# Altium schematic sheet Digital Camera.SchDoc
size A4; SheetSize: A4 P
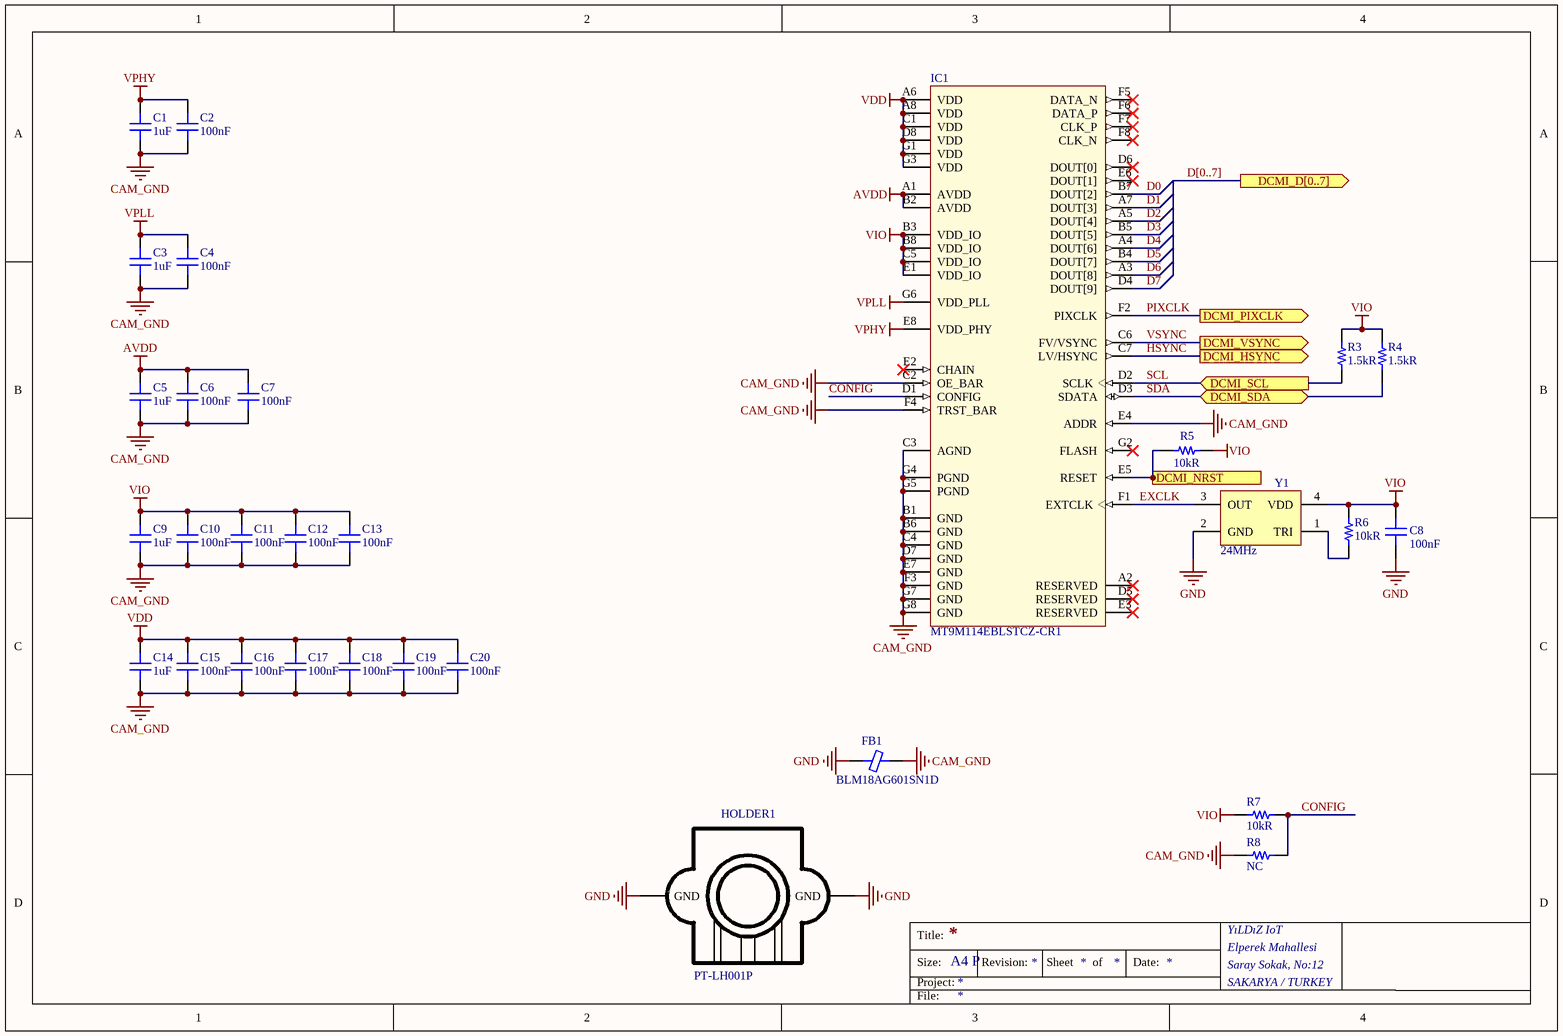
[diagram p0: Digital Camera.SchDoc]

## Parts
C1  1uF  [CAP 0603/1608]
C2  100nF  [CAP 0603/1608]
C3  1uF  [CAP 0603/1608]
C4  100nF  [CAP 0603/1608]
C5  1uF  [CAP 0603/1608]
C6  100nF  [CAP 0603/1608]
C7  100nF  [CAP 0603/1608]
C8  100nF  [CAP 0603/1608]
C9  1uF  [CAP 0603/1608]
C10  100nF  [CAP 0603/1608]
C11  100nF  [CAP 0603/1608]
C12  100nF  [CAP 0603/1608]
C13  100nF  [CAP 0603/1608]
C14  1uF  [CAP 0603/1608]
C15  100nF  [CAP 0603/1608]
C16  100nF  [CAP 0603/1608]
C17  100nF  [CAP 0603/1608]
C18  100nF  [CAP 0603/1608]
C19  100nF  [CAP 0603/1608]
C20  100nF  [CAP 0603/1608]
FB1  BLM18AG601SN1D  [FER 0603/1608]
HOLDER1  PT-LH001P  [M12 LENS HOLDER]
IC1  MT9M114EBLSTCZ-CR1  [ON SEMI MT9M114 BGA-55]
R3  1.5kR  [RES 0603/1608]
R4  1.5kR  [RES 0603/1608]
R5  10kR  [RES 0603/1608]
R6  10kR  [RES 0603/1608]
R7  10kR  [RES 0603/1608]
R8  10kR  [RES 0603/1608]  (value not drawn)  (no BOM)
Y1  24MHz  [Abracon ASTX-11]

## Ports
DCMI_D[0..7] (out), DCMI_HSYNC (out), DCMI_NRST (in), DCMI_PIXCLK (out), DCMI_SCL (in), DCMI_SDA (bidir), DCMI_VSYNC (out)

## Nets
AVDD: C5.2 C6.2 C7.2 IC1.A1(AVDD) IC1.B2(AVDD)
CAM_GND: C1.1 C2.1 C3.1 C4.1 C5.1 C6.1 C7.1 C9.1 C10.1 C11.1 C12.1 C13.1 C14.1 C15.1 C16.1 C17.1 C18.1 C19.1 C20.1 FB1.1 IC1.B1(GND) IC1.B6(GND) IC1.C2(OE_BAR) IC1.C3(AGND) IC1.C4(GND) IC1.D7(GND) IC1.E4(ADDR) IC1.E7(GND) IC1.F3(GND) IC1.F4(TRST_BAR) IC1.G4(PGND) IC1.G5(PGND) IC1.G7(GND) IC1.G8(GND) R8.1
GND: C8.1 FB1.2 HOLDER1.GND Y1.2(GND)
VDD: C14.2 C15.2 C16.2 C17.2 C18.2 C19.2 C20.2 IC1.A6(VDD) IC1.A8(VDD) IC1.C1(VDD) IC1.D8(VDD) IC1.G1(VDD) IC1.G3(VDD)
VIO: C8.2 C9.2 C10.2 C11.2 C12.2 C13.2 IC1.B3(VDD_IO) IC1.B8(VDD_IO) IC1.C5(VDD_IO) IC1.E1(VDD_IO) R3.2 R4.2 R5.1 R6.1 R7.1 Y1.4(VDD)
VPHY: C1.2 C2.2 IC1.E8(VDD_PHY)
VPLL: C3.2 C4.2 IC1.G6(VDD_PLL)
CONFIG: IC1.D1(CONFIG) R7.2 R8.2
D0: IC1.B7(DOUT[2])
D1: IC1.A7(DOUT[3])
D2: IC1.A5(DOUT[4])
D3: IC1.B5(DOUT[5])
D4: IC1.A4(DOUT[6])
D5: IC1.B4(DOUT[7])
D6: IC1.A3(DOUT[8])
D7: IC1.D4(DOUT[9])
DCMI_NRST: IC1.E5(RESET) R5.2 ; port DCMI_NRST
EXCLK: IC1.F1(EXTCLK) Y1.3(OUT)
HSYNC: IC1.C7(LV/HSYNC) ; port DCMI_HSYNC
PIXCLK: IC1.F2(PIXCLK) ; port DCMI_PIXCLK
SCL: IC1.D2(SCLK) R3.1 ; port DCMI_SCL
SDA: IC1.D3(SDATA) R4.1 ; port DCMI_SDA
VSYNC: IC1.C6(FV/VSYNC) ; port DCMI_VSYNC
NetR6_2: R6.2 Y1.1(TRI)

Not connected (* = marked no-connect by the designer): IC1 A2(RESERVED)* D5(RESERVED)* D6(DOUT[0])* E2(CHAIN)* E3(RESERVED)* E6(DOUT[1])* F5(DATA_N)* F6(DATA_P)* F7(CLK_P)* F8(CLK_N)* G2(FLASH)*

## Buses and harness runs
bus D[0..7] = port DCMI_D[0..7]

## Notes on the sheet
- Title:
- Size:
- Project:
- Revision:
- Sheet
- of
- Date:
- YıLDıZ IoT
- Elperek Mahallesi
- Saray Sokak, No:12
- SAKARYA / TURKEY
- File:

## Library data of the parts
C1 C3 C5 C9 C14 = Capacitor - Ceramic: Ceramic, SMT Capacitor; Manufacturer: Samsung; Manufacturer Part Number: CL10A105KP8NNNC; Tolerance: 10%; Voltage Rating: 10V; Dielectric: X5R; Supplier 1: Digi-Key; Supplier Part Number 1: 1276-1182-1-ND; Stock 1: 4590831; Pricing 1: 1 = 0,10000, 10 = 0,03800, 100 = 0,01680, 500 = 0,01200, 1000 = 0,00943 (USD); RoHS: Yes; Mount: Surface Mount; Case/Package: 0603; Case Code (Metric): 1608; Case Code (Imperial): 0603; Contact Plating: Tin; Min Operating Temperature: -55°C; Max Operating Temperature: 85°C; Packaging: Tape and Reel; Package Quantity: 1; Capacitance: 1uF; Voltage: 10V; Length: 1.6mm; Height: 0.8mm; Width: 0.031inch; Thickness: 0.035inch; Depth: 0.8mm; Radiation Hardening: No; ComponentLink1URL: https://datasheet.ciiva.com/15195/getdatasheetpartid-358616-15195708.pdf?src-supplier=Verical; ComponentLink1Description: https://datasheet.ciiva.com/15195/getdatasheetpartid-358616-15195708.pdf?src-supplier=Verical; ComponentLink2URL: https://datasheet.ciiva.com/16358/cl05b104kq5nnnc-16358431.pdf?src-supplier=Future+Electronics; ComponentLink2Description: https://datasheet.ciiva.com/16358/cl05b104kq5nnnc-16358431.pdf?src-supplier=Future+Electronics
C2 C4 C6-C8 C10-C13 C15-C20 = Capacitor - Ceramic: Ceramic, SMT Capacitor; Manufacturer: Samsung; Manufacturer Part Number: CL10B104JB8NNNC; Tolerance: 5%; Voltage Rating: 50V; Dielectric: X7R; Supplier 1: Digi-Key; Supplier Part Number 1: 1276-1033-1-ND; Stock 1: 223594; Pricing 1: 1 = 0,10000, 10 = 0,05300, 100 = 0,02350, 500 = 0,01680, 1000 = 0,01320 (USD); RoHS: Yes; Mount: Surface Mount; Case/Package: 0603; Case Code (Metric): 1608; Case Code (Imperial): 0603; Material: Ceramic; Contact Plating: Tin; Min Operating Temperature: -55°C; Max Operating Temperature: 125°C; Packaging: Tape and Reel; Package Quantity: 1; Capacitance: 100nF; Voltage: 50V; Length: 1.6mm; Height: 0.8mm; Width: 0.031inch; Thickness: 0.035inch; Depth: 0.8mm; Radiation Hardening: No; ComponentLink1URL: https://media.digikey.com/pdf/Data%20Sheets/Samsung%20PDFs/CL_Series_MLCC_ds.pdf?src-supplier=Digi-Key; ComponentLink1Description: https://media.digikey.com/pdf/Data%20Sheets/Samsung%20PDFs/CL_Series_MLCC_ds.pdf?src-supplier=Digi-Key; ComponentLink2URL: https://www.verical.com/server-webapp/html/getDatasheet?partID=359321&src-supplier=Verical; ComponentLink2Description: https://www.verical.com/server-webapp/html/getDatasheet?partID=359321&src-supplier=Verical; ComponentLink3URL: http://www1.futureelectronics.com/doc/SAMSUNG/CL10B104JB8NNNC.pdf?src-supplier=Future+Electronics; ComponentLink3Description: http://www1.futureelectronics.com/doc/SAMSUNG/CL10B104JB8NNNC.pdf?src-supplier=Future+Electronics; ComponentLink4URL: https://produktinfo.conrad.com/datenblaetter/450000-474999/456613-da-01-en-VS_KONDENSATOR_0603.pdf?src-supplier=Conrad; ComponentLink4Description: https://produktinfo.conrad.com/datenblaetter/450000-474999/456613-da-01-en-VS_KONDENSATOR_0603.pdf?src-supplier=Conrad
FB1 = Ferrite Chip: SMT Ferrite Chip; Manufacturer: Murata; Material: Steel; Frequency: 100MHz; Tolerance: 25%; Impedance: 600R; Max Current Rating: 500mA; Number of Lines: 1; DC Resistance (DCR): 380mR; Shielding: Unshielded; Supplier 1: Digi-Key; Supplier Part Number 1: 490-1014-1-ND; Manufacturer Part Number: BLM18AG601SN1D; Stock 1: 1151376; Pricing 1: 1 = 0,10000, 10 = 0,07900, 25 = 0,07200, 50 = 0,06480, 100 = 0,04760, 250 = 0,03460, 500 = 0,03170, 1000 = 0,02738 (USD); RoHS: Yes; Case/Package: 0603; Number of Pins: 2; Weight: 7.1E-05oz; Core Material: Ferrite; Case Code (Metric): 1608; Case Code (Imperial): 0603; Min Operating Temperature: -55°C; Max Operating Temperature: 125°C; Package Quantity: 1; Packaging: Tape and Reel; Current Rating: 500mA; Termination: SMD/SMT; Max DC Current: 500mA; Test Frequency: 100MHz; DC Current: 500mA; Military Standard: Not; Number of Circuits: 1; Length: 1.6mm; Height: 0.8mm; Width: 0.8mm; Depth: 0.8mm; Radiation Hardening: No; Lead Free: Lead Free; REACH SVHC: No SVHC; ComponentLink1URL: https://datasheet.ciiva.com/19460/1844766-19460213.pdf?src-supplier=Jameco; ComponentLink1Description: https://datasheet.ciiva.com/19460/1844766-19460213.pdf?src-supplier=Jameco; ComponentLink2URL: https://datasheet.ciiva.com/29347/442309-da-01-en-chip-drossel-0603-600r-500ma-1-6x0-8mm-29347900.pdf?src-supplier=Conrad; ComponentLink2Description: https://datasheet.ciiva.com/29347/442309-da-01-en-chip-drossel-0603-600r-500ma-1-6x0-8mm-29347900.pdf?src-supplier=Conrad; ComponentLink3URL: https://datasheet.ciiva.com/41449/001172228-da-01-en-drossel-0603-600r-1-6x0-8mm-4000st-41449517.pdf?src-supplier=Conrad; ComponentLink3Description: https://datasheet.ciiva.com/41449/001172228-da-01-en-drossel-0603-600r-1-6x0-8mm-4000st-41449517.pdf?src-supplier=Conrad; ComponentLink4URL: https://datasheet.ciiva.com/1012/l0110s0100blm18a-1012018.pdf?src-supplier=Digi-Key; ComponentLink4Description: https://datasheet.ciiva.com/1012/l0110s0100blm18a-1012018.pdf?src-supplier=Digi-Key; ComponentLink5URL: https://datasheet.ciiva.com/1012/l0110s0100blm18a-1012019.pdf?src-supplier=Digi-Key; ComponentLink5Description: https://datasheet.ciiva.com/1012/l0110s0100blm18a-1012019.pdf?src-supplier=Digi-Key; ComponentLink6URL: https://datasheet.ciiva.com/1466/1756147-1466934.pdf?src-supplier=Element14; ComponentLink6Description: https://datasheet.ciiva.com/1466/1756147-1466934.pdf?src-supplier=Element14; ComponentLink7URL: https://datasheet.ciiva.com/3081/l0110s0100blm18a-3081613.pdf?src-supplier=Avnet; ComponentLink7Description: https://datasheet.ciiva.com/3081/l0110s0100blm18a-3081613.pdf?src-supplier=Avnet; ComponentLink8URL: https://datasheet.ciiva.com/1012/l0110s0100blm18a-1012017.pdf?src-supplier=Digi-Key; ComponentLink8Description: https://datasheet.ciiva.com/1012/l0110s0100blm18a-1012017.pdf?src-supplier=Digi-Key; ComponentLink9URL: https://datasheet.ciiva.com/1466/1756147-1466933.pdf?src-supplier=Element14; ComponentLink9Description: https://datasheet.ciiva.com/1466/1756147-1466933.pdf?src-supplier=Element14; ComponentLink10URL: https://datasheet.ciiva.com/16210/l0110s0100blm18a-16210006.pdf?src-supplier=Future+Electronics; ComponentLink10Description: https://datasheet.ciiva.com/16210/l0110s0100blm18a-16210006.pdf?src-supplier=Future+Electronics
HOLDER1 = LENS HOLDER: Pricing 1: 1 = 3,00 (USD); Supplier: m12lenses; Supplier Link: http://www.m12lenses.com/M12-Lens-Holder-Plastic-p/pt-lh001p.htm; Supplier Part Number: PT-LH001P; Manufacturer Part Number: PT-LH001P; Manufacturer: *
IC1 = ON SEMI MT9M114: 1/6‐inch 720p High‐Definition (HD) System‐On‐a‐Chip (SOC) Digital Image Sensor; Manufacturer: ON Semiconductor; Supplier 1: Digi-Key; Supplier Part Number 1: MT9M114EBLSTCZ-CR1-ND; Manufacturer Part Number: MT9M114EBLSTCZ-CR1; Stock 1: 425; Pricing 1: 1 = 7,38000, 5 = 6,47200, 10 = 5,82500, 25 = 5,17800, 50 = 4,78960, 100 = 4,14240, 500 = 3,88350, 1000 = 3,62460 (USD); RoHS: No; Lead Free: Lead Free
R3 R4 = Resistor_Chip: Ceramic, SMT Capacitor; Manufacturer: Yageo; Manufacturer Part Number: RC0603FR-071K5L; Tolerance: 1%; Voltage Rating (DC): 50V; Temperature Coefficient: 100ppm/°C; Power Rating: 100mW; Supplier 1: Digi-Key; Supplier Part Number 1: 311-1.50KHRCT-ND; Stock 1: 4073514; Pricing 1: 1 = 0,10000, 10 = 0,02300, 100 = 0,00940, 1000 = 0,00421, 2500 = 0,00366 (USD); RoHS: Yes; Case/Package: 0603; Number of Pins: 2; Case Code (Metric): 1608; Case Code (Imperial): 0603; Min Operating Temperature: -55°C; Max Operating Temperature: 155°C; Packaging: Tape and Reel; Resistance: 1.5kR; Composition: Thick Film; Voltage Rating: 50V; Number of Terminations: 2; Termination: SMD/SMT; Military Standard: Not; Package Quantity: 1; Features: Moisture Resistant; Max Power Dissipation: 100mW; Length: 0.063inch; Height: 0.022inch; Width: 0.031inch; Depth: 0.8mm; REACH SVHC: No SVHC; Lead Free: Lead Free; ComponentLink1URL: https://datasheet.ciiva.com/2454/pyu-r-int-thick-7-2454513.pdf?src-supplier=Digi-Key; ComponentLink1Description: https://datasheet.ciiva.com/2454/pyu-r-int-thick-7-2454513.pdf?src-supplier=Digi-Key; ComponentLink2URL: https://datasheet.ciiva.com/2454/pyu-r-int-thick-7-2454514.pdf?src-supplier=Digi-Key; ComponentLink2Description: https://datasheet.ciiva.com/2454/pyu-r-int-thick-7-2454514.pdf?src-supplier=Digi-Key; ComponentLink3URL: https://datasheet.ciiva.com/2454/pyu-r-int-thick-7-2454515.pdf?src-supplier=Digi-Key; ComponentLink3Description: https://datasheet.ciiva.com/2454/pyu-r-int-thick-7-2454515.pdf?src-supplier=Digi-Key; ComponentLink4URL: https://datasheet.ciiva.com/46440/1868787-46440895.pdf?src-supplier=Element14; ComponentLink4Description: https://datasheet.ciiva.com/46440/1868787-46440895.pdf?src-supplier=Element14
R5-R8 = Resistor_Chip: Ceramic, SMT Capacitor; Manufacturer: Stackpole Electronics; Manufacturer Part Number: RNCP0603FTD10K0; Tolerance: 1%; Max Power Dissipation: 125mW; Temperature Coefficient: 100ppm/°C; Supplier 1: Digi-Key; Supplier Part Number 1: RNCP0603FTD10K0CT-ND; Stock 1: 183083; Pricing 1: 1 = 0,10000, 10 = 0,06700, 100 = 0,02730, 1000 = 0,01224, 2500 = 0,01063 (USD); RoHS: Yes; Mount: Surface Mount; Case/Package: 0603; Case Code (Metric): 1608; Case Code (Imperial): 0603; Contact Plating: Matte,Tin; Min Operating Temperature: -55°C; Max Operating Temperature: 155°C; Packaging: Tape and Reel; Resistance: 10kR; Composition: Thin Film; Number of Terminations: 2; Features: Anti-Sulfur,Moisture Resistant; Length: 0.059inch; Height: 0.02inch; Width: 0.031inch; Radiation Hardening: No; Lead Free: Lead Free
  R8: NC: NC
Y1 = ASD1-1.544MHZ-EC-T: OSC XO 1.544MHZ CMOS SMD; Manufacturer: ECS Inc.; Manufacturer Part Number: ECS-3225MV-240-CN-TR; Base Resonator: Crystal; Function: Enable/Disable; Output: HCMOS; Voltage - Supply: 1.62V ~ 3.63V; Frequency Stability: ±25ppm; ComponentLink1Description: Datasheet; ComponentLink1URL: http://www.abracon.com/Oscillators/ASDseries.pdf; ComponentLink2Description: Digi-Key Listing; ComponentLink2URL: https://www.digikey.com/product-detail/en/ASD1-1.544MHZ-EC-T/535-9579-2-ND/1236896; Supplier 1: Digi-Key; Supplier Part Number 1: XC2884CT-ND; Stock 1: 1655; Pricing 1: 1 = 0,92000, 10 = 0,81700, 50 = 0,76380, 100 = 0,67510, 500 = 0,63954 (USD); RoHS: No; ComponentLink3URL: https://www.ecsxtal.com/store/pdf/ECS-3225MV.pdf?src-supplier=Digi-Key; ComponentLink3Description: https://www.ecsxtal.com/store/pdf/ECS-3225MV.pdf?src-supplier=Digi-Key; Packaging: Cut Tape (CT); Type: XO (Standard); Frequency: 24MHz; Series: ECS-3225MV